# EAGLE design Hyphen-Launch-Computer (EAGLE 9.4.2)
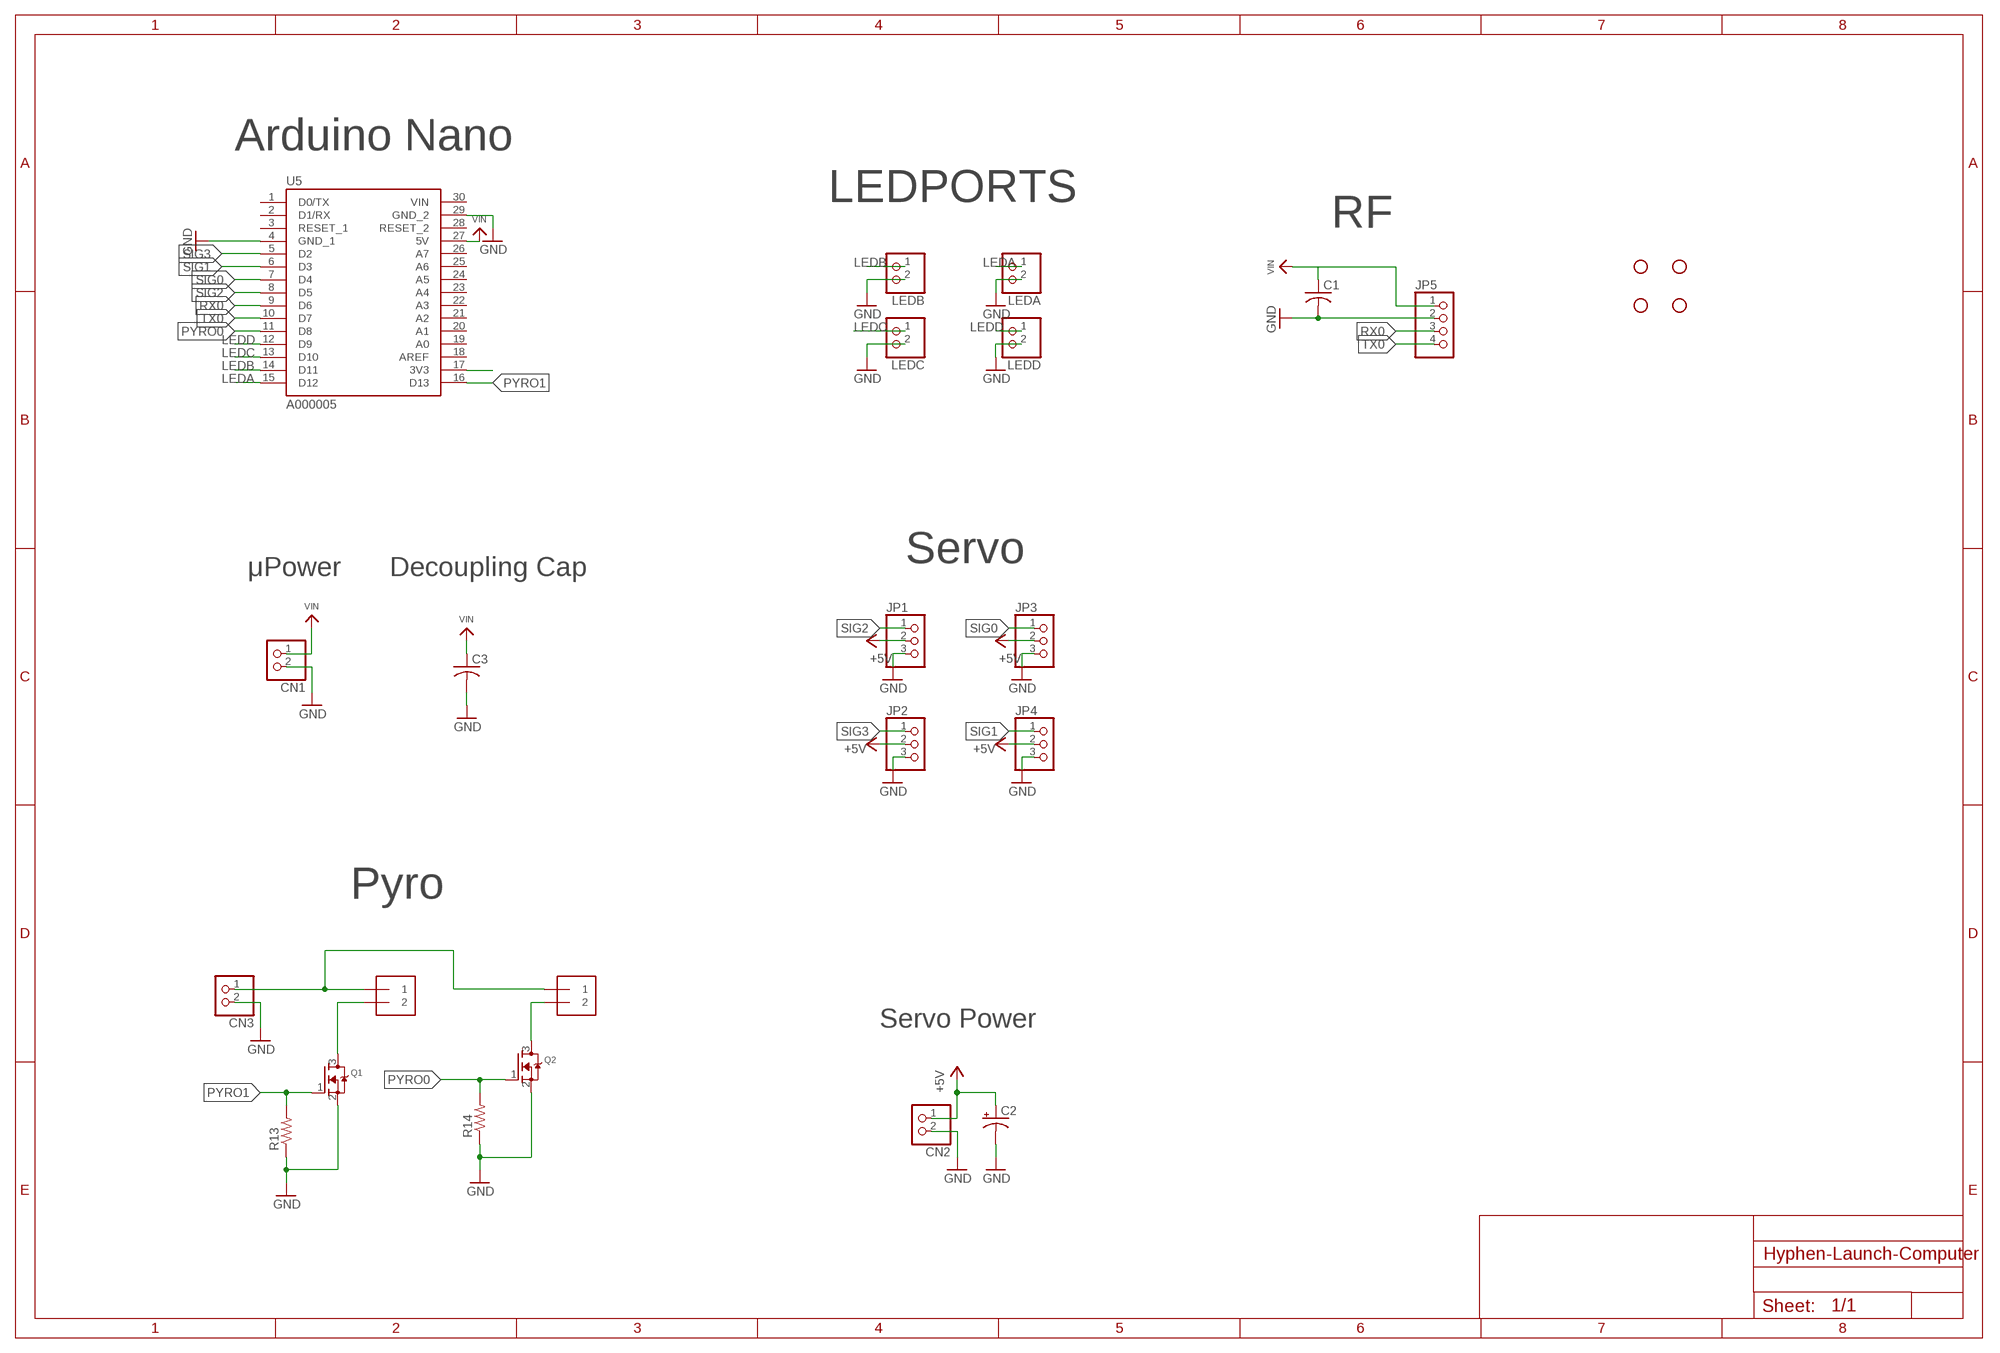
[diagram p0: schematic, sheet 1]

## Parts
C1  C-USC0805  [C0805]
C2  CPOL-USE3.5-8  [E3,5-8]
C3  C-USC0805  [C0805]
CN1  JST_2PIN-SMT-RA  [JST-PH-2-SMT-RA]
CN2  JST_2PIN-SMT-RA  [JST-PH-2-SMT-RA]
CN3  JST_2PIN-SMT-RA  [JST-PH-2-SMT-RA]
H1  STAND-OFF  [STAND-OFF]
H2  STAND-OFF  [STAND-OFF]
H3  STAND-OFF  [STAND-OFF]
H4  STAND-OFF  [STAND-OFF]
J2  1X2-3.5MM  [1X2-3.5MM]
J6  1X2-3.5MM  [1X2-3.5MM]
JP1  PINHD-1X3  [1X03]
JP2  PINHD-1X3  [1X03]
JP3  PINHD-1X3  [1X03]
JP4  PINHD-1X3  [1X03]
JP5  PINHD-1X4  [1X04]
LEDA  JST_2PIN-SMT-RA  [JST-PH-2-SMT-RA]
LEDB  JST_2PIN-SMT-RA  [JST-PH-2-SMT-RA]
LEDC  JST_2PIN-SMT-RA  [JST-PH-2-SMT-RA]
LEDD  JST_2PIN-SMT-RA  [JST-PH-2-SMT-RA]
Q1  MOSFET-NREFLOW  [SOT23]
Q2  MOSFET-NREFLOW  [SOT23]
R13  R-US_M0805  [M0805]
R14  R-US_M0805  [M0805]
U5  A000005  [MODULE_A000005]

## Nets
+5V: C2.+ CN2.1 JP1.2 JP2.2 JP3.2 JP4.2
GND: C1.2 C2.- C3.2 CN1.2 CN2.2 CN3.2 JP1.3 JP2.3 JP3.3 JP4.3 JP5.2 LEDA.2 LEDB.2 LEDC.2 LEDD.2 Q1.2(S) Q2.2(S) R13.1 R14.1 U5.4(GND_1) U5.29(GND_2)
LEDA: LEDA.1 U5.15(D12)
LEDB: LEDB.1 U5.14(D11)
LEDC: LEDC.1 U5.13(D10)
LEDD: LEDD.1 U5.12(D9)
N$5: U5.17(3V3)
N$11: CN3.1 J2.1 J6.1
N$19: J2.2 Q1.3(D)
N$20: J6.2 Q2.3(D)
PYRO0: Q2.1(G) R14.2 U5.11(D8)
PYRO1: Q1.1(G) R13.2 U5.16(D13)
RX0: JP5.3 U5.9(D6)
SIG0: JP3.1 U5.7(D4)
SIG1: JP4.1 U5.6(D3)
SIG2: JP1.1 U5.8(D5)
SIG3: JP2.1 U5.5(D2)
TX0: JP5.4 U5.10(D7)
VIN: C1.1 C3.1 CN1.1 JP5.1 U5.27(5V)
Unconnected: U5.1(D0/TX) U5.2(D1/RX) U5.3(RESET_1) U5.18(AREF) U5.19(A0) U5.20(A1) U5.21(A2) U5.22(A3) U5.23(A4) U5.24(A5) U5.25(A6) U5.26(A7) U5.28(RESET_2)

## Notes on the sheet
- Arduino Nano
- LEDPORTS
- RF
- Servo
- μPower | Decoupling Cap
- Pyro
- Servo Power

## Power pins joined to a net without a drawn wire
VIN: U5.30(VIN)

## Library data of the parts
C1 C3 = adafruit:C-US: CAPACITOR, American symbol
C2 = adafruit:CPOL-US: POLARIZED CAPACITOR, American symbol
CN1-CN3 LEDA LEDB LEDC LEDD = adafruit:JST_2PIN: JST 2-Pin Connectors of various flavors SMT-RA (S2B-PH-SM4) 4UConnector #17311 SMT (B2B-PH-SM4) THM-RA (S2B-PH) THM (B2B-PH)
H1-H4 = SparkFun-Hardware:STAND-OFF: Stand Off Drill holes for mechanically mounting via screws, standoffs, etc. Note: Use the keepout ring to avoid running the screw head into surrounding components. Variant Overviews STAND-OFF - Mechanical footprint for a #4 phillips button head screw. STAND-OFF-TIGHT - Mechanical footprint for a #4 phillips button head screw, Example SparkFun Products Screw - Phillips Head (1/4", 4-40, 10 pack) <https://www.sparkfun.com/products/10453> (PRT-10453) Screw - Phillips Head (1/2", 4-40, 10 pack) <https://www.sparkfun.com/products/10452> (PRT-10452) Screw - Phillips Head (3/4", 4-40, 10 pack) <https://www.sparkfun.com/products/10451> (PRT-10451) Screw - Phillips Head (1", 4-40, 10 pack) <https://www.sparkfun.com/products/10450> (PRT-10450)
J2 J6 = adafruit:1X2: 3.5mm Terminal block http://www.ladyada.net/library/pcb/eaglelibrary.html
JP1-JP4 = adafruit:PINHD-1X3: PIN HEADER
JP5 = pinhead:PINHD-1X4: PIN HEADER
Q1 Q2 = adafruit:MOSFET-N: N-Channel Mosfet 2N7002E - 60V 260mA SOT23 [Digikey: 2N7002ET1GOSTR-ND] - REEL BSH103 - 30V 850mA SOT23 [Digikey: 568-5013-1-ND]
R13 R14 = adafruit:R-US_: RESISTOR, American symbol
U5 = ardunio-nano:A000005: CLOCK SAW OSCILLATOR SEAM7050 T&; AVAILABILITY: Unavailable; DESCRIPTION: ATmega328 Arduino Nano AVR® ATmega AVR MCU 8-Bit Embedded Evaluation Board; MF: Arduino; MP: A000005; PACKAGE: None; PRICE: None

## Board
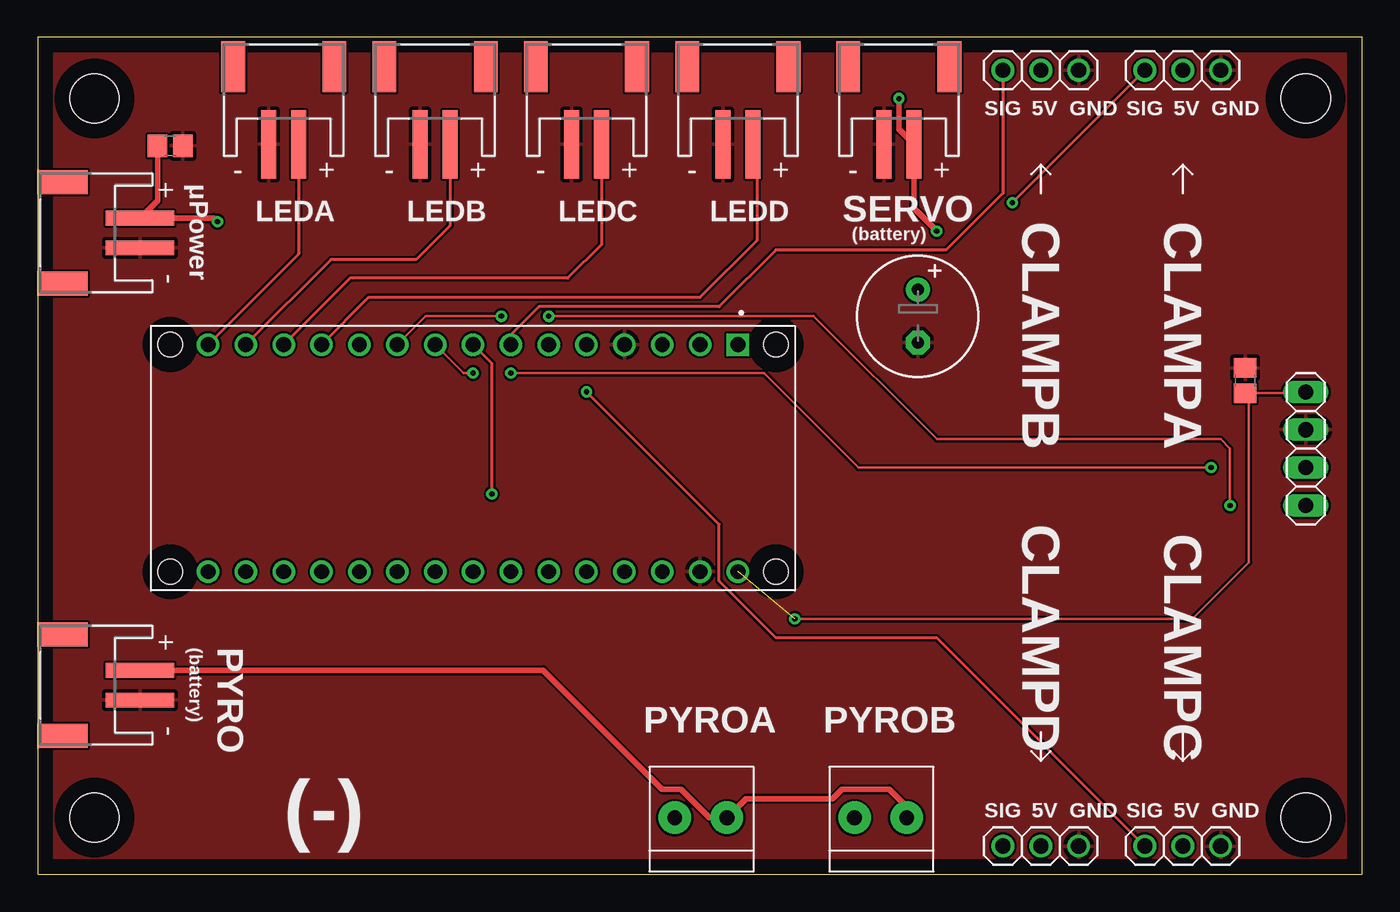
[diagram p1: board, top side]
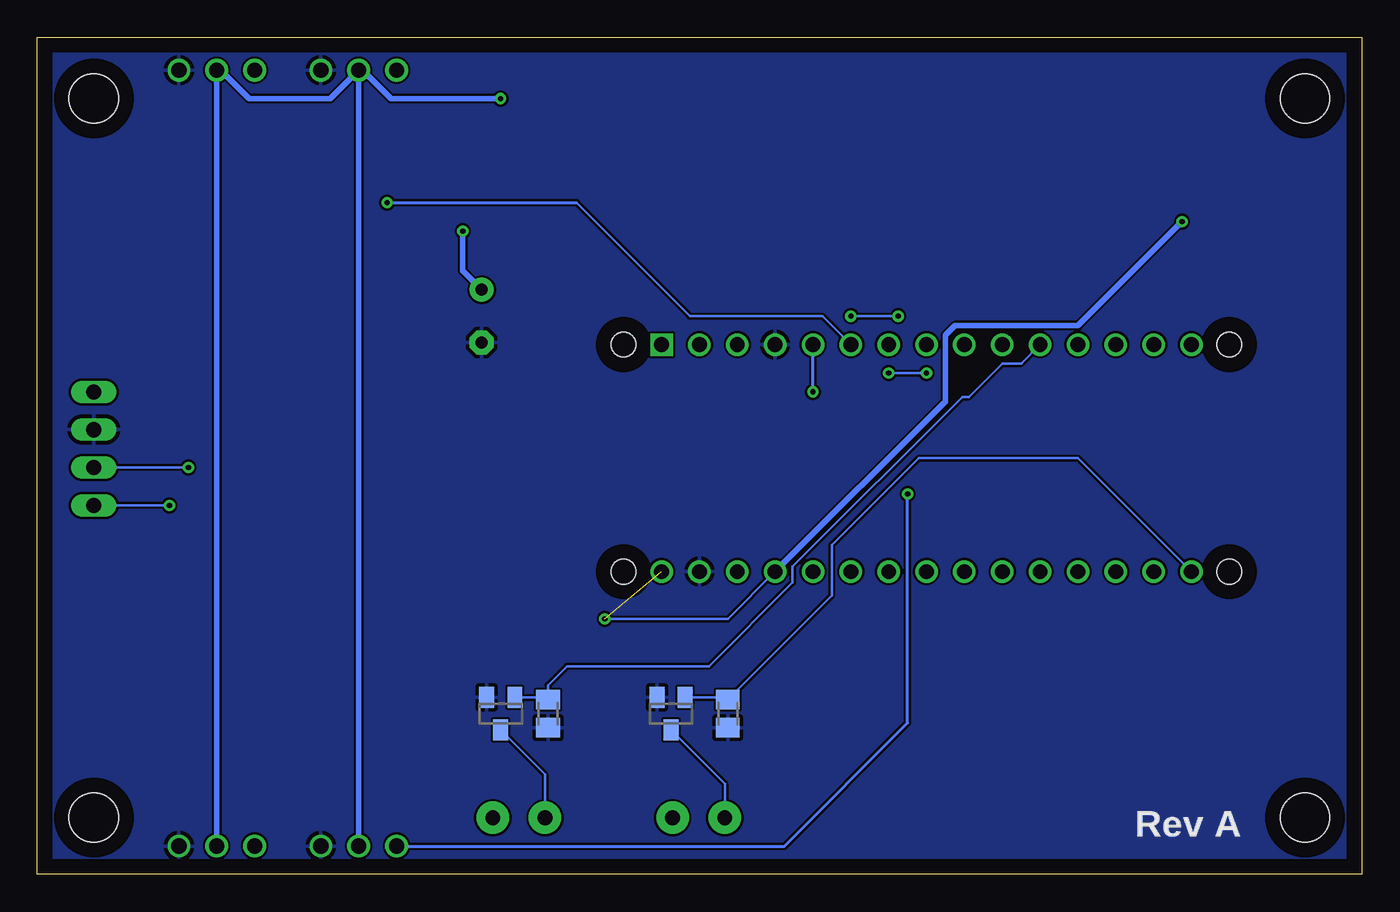
[diagram p2: board, bottom side, seen from below]

Size 88.88 x 56.18 mm. Coordinates in mm from the lower left corner, seen from the top.
Outline: 0,0 88.88,0 88.88,56.18 0,56.18 0,0
Copper layers (1*16): Top 0.035mm / dielectric 1.5mm / Bottom 0.035mm
Design rules "default": minimum track width 6mil, minimum drill 0.35mm, track to track 6mil, track to pad 6mil, pad to pad 6mil, via to via 6mil, smd to smd 6mil, copper to edge 40mil, drill to drill 6mil, minimum pad ring 10mil, minimum via ring 8mil, stop-mask expansion 4mil, vias tented up to drill 0mil, thermal gap 10mil

### Footprints (pad centres in the part's own frame; a part is rotated, then mirrored left to right if it is on the bottom)
C0805 = smd 1.3 x 1.5: 1 -0.85,0; 2 0.85,0
E3,5-8 = drill 0.813 pad 1.6: + -1.778,0 | drill 0.813 pad 1.6 octagon: - 1.778,0
JST-PH-2-SMT-RA = smd 1 x 4.6: 1 1,-3.7; 2 -1,-3.7 | smd 1.6 x 3.4: NC1 -3.4,1.5; NC2 3.4,1.5
STAND-OFF = hole 3.302: 0,0
1X2-3.5MM = drill 1 pad 2.184: 1 1.8,0; 2 -1.7,0
1X03 = drill 1.016: 1 -2.54,0; 2 0,0; 3 2.54,0
1X04 = drill 1.016 long: 1 -3.81,0; 2 -1.27,0; 3 1.27,0; 4 3.81,0
SOT23 = smd 1 x 1.4: 1 -0.95,-1.1; 2 0.95,-1.1; 3 0,1.1
M0805 = smd 1.3 x 1.6: 1 -0.95,0; 2 0.95,0
MODULE_A000005 = drill 1 square: 1 -7.62,17.78 | drill 1: 2 -7.62,15.24; 3 -7.62,12.7; 4 -7.62,10.16; 5 -7.62,7.62; 6 -7.62,5.08; 7 -7.62,2.54; 8 -7.62,0; 9 -7.62,-2.54; 10 -7.62,-5.08; 11 -7.62,-7.62; 12 -7.62,-10.16; 13 -7.62,-12.7; 14 -7.62,-15.24; 15 -7.62,-17.78; 16 7.62,-17.78; 17 7.62,-15.24; 18 7.62,-12.7; 19 7.62,-10.16; 20 7.62,-7.62; 21 7.62,-5.08; 22 7.62,-2.54; 23 7.62,0; 24 7.62,2.54; 25 7.62,5.08; 26 7.62,7.62; 27 7.62,10.16; 28 7.62,12.7; 29 7.62,15.24; 30 7.62,17.78 | hole 1.651: -7.62,-20.32; 7.62,-20.32; -7.62,20.32; 7.62,20.32

### Placement (x,y rotation side)
C1  81.03,33.15 90 top
C2  59.05,37.46 270 top
C3  8.89,48.9 0 top
CN1  3.18,43.05 90 top
CN2  57.78,52.7 0 top
CN3  3.18,12.7 90 top
H1  3.81,3.81 0 top
H2  85.09,3.81 0 top
H3  85.09,52.07 0 top
H4  3.81,52.07 0 top
J2  44.45,3.81 0 top
J6  56.52,3.81 0 top
JP1  67.31,1.9 0 top
JP2  76.84,1.9 0 top
JP3  67.31,53.98 0 top
JP4  76.84,53.98 0 top
JP5  85.09,28.57 270 top
LEDA  16.51,52.7 0 top
LEDB  26.67,52.7 0 top
LEDC  36.83,52.7 0 top
LEDD  46.99,52.7 0 top
Q1  46.35,10.79 180 bottom
Q2  57.78,10.79 180 bottom
R13  42.55,10.79 90 bottom
R14  54.61,10.79 90 bottom
U5  29.21,27.94 270 top

### Tracks (layer width: path | path; a pad name or v marks a point on that pad's centre or on a via)
+5V  (via drill 0.35)
  Top 0.381: v57.78,52.07 57.78,50.01 CN2.1 58.78,44.72 v60.32,43.18
  Bottom 0.381: v57.78,52.07 65.15,52.07 67.06,53.98 JP3.2 | JP3.2 69.22,52.07 74.68,52.07 76.58,53.98 JP4.2 JP2.2 | JP3.2 JP1.2 | v60.32,43.18 60.32,40.51 C2.+
GND
  pour Top: 0,0 0,56.51 88.9,56.51 88.9,0
  pour Bottom: 0,0 0,56.51 88.9,56.51 88.9,0
LEDA
  Top 0.203: LEDA.1 17.51,41.64 U5.15
LEDB
  Top 0.203: LEDB.1 27.67,43.54 25.4,41.27 19.69,41.27 U5.14
LEDC
  Top 0.203: LEDC.1 37.83,42.27 35.56,40 20.96,40 U5.13
LEDD
  Top 0.203: U5.12 22.23,38.73 44.45,38.73 48.26,42.54 48.26,49.27 LEDD.1
N$11
  Top 0.381: CN3.1 33.92,13.7 41.91,5.71 43.18,5.71 45.09,3.81 J2.1 47.52,5.08 53.34,5.08 53.98,5.71 57.15,5.71 58.31,4.55 J6.1
N$19
  Bottom 0.152: Q1.3 42.75,6.09 J2.2
N$20
  Bottom 0.152: Q2.3 54.81,6.72 J6.2
PYRO0
  Bottom 0.152: Q2.1 54.76,11.9 R14.2 54.61,12.7 53.34,13.97 43.81,13.97 38.19,19.59 38.19,20.66 26.8,32.05 26.37,32.05 24.13,34.29 22.86,34.29 U5.11
PYRO1
  Bottom 0.152: Q1.1 42.7,11.9 R13.2 35.56,18.73 35.56,22.1 29.72,27.94 19.05,27.94 U5.16
RX0  (via drill 0.35)
  Top 0.152: v31.75,33.66 48.72,33.66 55.07,27.3 v78.74,27.3 | v29.21,33.66 28.58,33.66 U5.9
  Bottom 0.152: v31.75,33.66 v29.21,33.66 | v78.74,27.3 JP5.3
SIG0
  Top 0.203: JP3.1 64.77,45.72 60.96,41.91 49.53,41.91 45.72,38.1 33.66,38.1 31.75,36.2 U5.7
SIG1  (via drill 0.35)
  Top 0.203: JP4.1 v65.41,45.09
  Bottom 0.152: 52.7,45.09 45.09,37.46 36.2,37.46 U5.6
  Bottom 0.203: v65.41,45.09 52.7,45.09
SIG2  (via drill 0.35)
  Top 0.203: U5.8 30.48,34.29 v30.48,25.53
  Bottom 0.203: JP1.1 38.73,1.9 30.48,10.16 v30.48,25.53
SIG3  (via drill 0.35)
  Top 0.203: JP2.1 60.32,15.87 49.53,15.87 45.72,19.68 45.72,23.49 v36.83,32.38
  Bottom 0.203: v36.83,32.38 U5.5
TX0  (via drill 0.35)
  Top 0.152: v34.29,37.46 34.3,37.48 52.06,37.48 60.32,29.21 79.38,29.21 80.01,28.57 v80.01,24.77 | v31.12,37.46 26.04,37.46 U5.10
  Bottom 0.152: v34.29,37.46 v31.12,37.46 | v80.01,24.77 JP5.4
VIN  (via drill 0.35)  (1 unrouted)
  Top 0.152: v50.8,17.14 77.47,17.14 81.28,20.95 81.28,32.04 C1.1 85,32.3 JP5.1
  Top 0.381: v12.07,43.81 11.83,44.05 CN1.1 8.04,45.22 C3.1
  Bottom 0.152: v50.8,17.14 42.55,17.14 U5.27
  Bottom 0.381: v12.07,43.81 19.05,36.83 27.3,36.83 27.94,36.2 27.94,31.75 U5.27

### Text on the board
tPlace: SIG | 5V | GND | SIG | 5V | GND | μPower | SERVO | CLAMPB | CLAMPA | (battery) | CLAMPD | CLAMPC | (battery) | PYRO | PYROA | PYROB | SIG | 5V | GND | SIG | 5V | GND | (-)
bPlace: Rev A